# EAGLE schematic Watson (EAGLE 6.2)
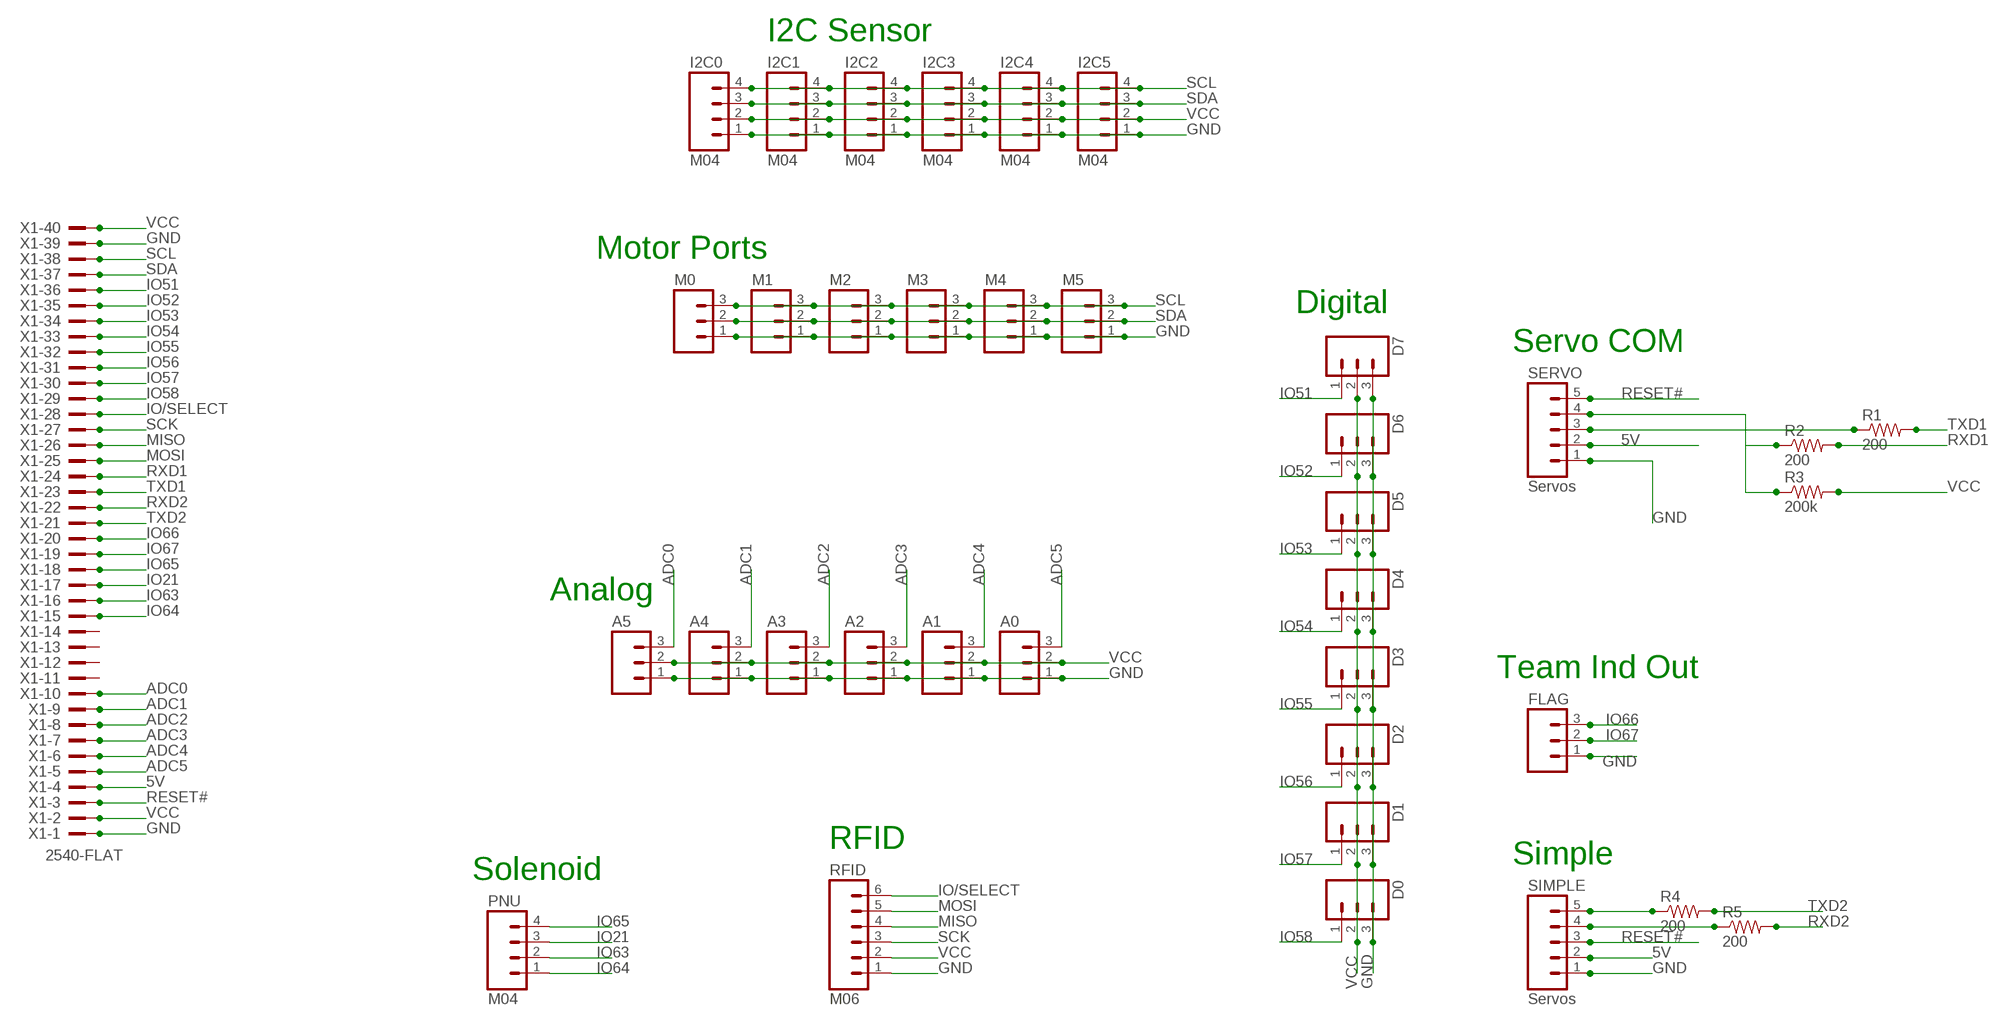
[diagram p0: schematic, sheet 1]

## Parts
A0  M03MTA1X3  [1X03]
A1  M03MTA1X3  [1X03]
A2  M03MTA1X3  [1X03]
A3  M03MTA1X3  [1X03]
A4  M03MTA1X3  [1X03]
A5  M03MTA1X3  [1X03]
D0  M03MTA1X3  [1X03]
D1  M03MTA1X3  [1X03]
D2  M03MTA1X3  [1X03]
D3  M03MTA1X3  [1X03]
D4  M03MTA1X3  [1X03]
D5  M03MTA1X3  [1X03]
D6  M03MTA1X3  [1X03]
D7  M03MTA1X3  [1X03]
FLAG  M03MTA1X3  [1X03]
I2C0  M04  [1X04]
I2C1  M04  [1X04]
I2C2  M04  [1X04]
I2C3  M04  [1X04]
I2C4  M04  [1X04]
I2C5  M04  [1X04]
M0  M03MTA1X3  [1X03]
M1  M03MTA1X3  [1X03]
M2  M03MTA1X3  [1X03]
M3  M03MTA1X3  [1X03]
M4  M03MTA1X3  [1X03]
M5  M03MTA1X3  [1X03]
PNU  M04  [1X04]
R1  200  R-US_R0603  [R0603]
R2  200  R-US_R0603  [R0603]
R3  200k  R-US_R0603  [R0603]
R4  200  R-US_R0603  [R0603]
R5  200  R-US_R0603  [R0603]
RFID  M06  [1X06]
SERVO  Servos  M05  [1X05]
SIMPLE  Servos  M05  [1X05]
X1  2540-FLAT  [PAK100/2500-40]

## Nets
5V: SERVO.2 SIMPLE.2 X1.4
ADC0: A5.3 X1.10
ADC1: A4.3 X1.9
ADC2: A3.3 X1.8
ADC3: A2.3 X1.7
ADC4: A1.3 X1.6
ADC5: A0.3 X1.5
GND: A0.1 A1.1 A2.1 A3.1 A4.1 A5.1 D0.3 D1.3 D2.3 D3.3 D4.3 D5.3 D6.3 D7.3 FLAG.1 I2C0.1 I2C1.1 I2C2.1 I2C3.1 I2C4.1 I2C5.1 M0.1 M1.1 M2.1 M3.1 M4.1 M5.1 RFID.1 SERVO.1 SIMPLE.1 X1.1 X1.39
IO21: PNU.3 X1.17
IO51: D7.1 X1.36
IO52: D6.1 X1.35
IO53: D5.1 X1.34
IO54: D4.1 X1.33
IO55: D3.1 X1.32
IO56: D2.1 X1.31
IO57: D1.1 X1.30
IO58: D0.1 X1.29
IO63: PNU.2 X1.16
IO64: PNU.1 X1.15
IO65: PNU.4 X1.18
IO66: FLAG.3 X1.20
IO67: FLAG.2 X1.19
IO/SELECT: RFID.6 X1.28
MISO: RFID.4 X1.26
MOSI: RFID.5 X1.25
N$1: R2.1 R3.1 SERVO.4
N$2: R1.1 SERVO.3
N$5: R4.1 SIMPLE.5
N$6: R5.1 SIMPLE.4
RESET#: SERVO.5 SIMPLE.3 X1.3
RXD1: R2.2 X1.24
RXD2: R5.2 X1.22
SCK: RFID.3 X1.27
SCL: I2C0.4 I2C1.4 I2C2.4 I2C3.4 I2C4.4 I2C5.4 M0.3 M1.3 M2.3 M3.3 M4.3 M5.3 X1.38
SDA: I2C0.3 I2C1.3 I2C2.3 I2C3.3 I2C4.3 I2C5.3 M0.2 M1.2 M2.2 M3.2 M4.2 M5.2 X1.37
TXD1: R1.2 X1.23
TXD2: R4.2 X1.21
VCC: A0.2 A1.2 A2.2 A3.2 A4.2 A5.2 D0.2 D1.2 D2.2 D3.2 D4.2 D5.2 D6.2 D7.2 I2C0.2 I2C1.2 I2C2.2 I2C3.2 I2C4.2 I2C5.2 R3.2 RFID.2 X1.2 X1.40
Unconnected: X1.11 X1.12 X1.13 X1.14

## Notes on the sheet
- I2C Sensor
- Motor Ports
- Digital
- Servo COM
- Analog
- Team Ind Out
- RFID
- Simple
- Solenoid

## Library data of the parts
A0 A1-A5 D0 D1-D7 FLAG M0 M1-M5 = pie:M03: Header 3 Standard 3-pin 0.1" header. Use with straight break away headers (SKU : PRT-00116), right angle break away headers (PRT-00553), swiss pins (PRT-00743), machine pins (PRT-00117), and female headers (PRT-00115). Molex polarized connector foot print use with SKU : PRT-08232 with associated crimp pins and housings.
I2C0 I2C1-I2C5 PNU = MTA-connectors:M04
R1-R5 = resistor:R-US_: RESISTOR, American symbol
RFID = MTA-connectors:M06
SERVO SIMPLE = MTA-connectors:M05
X1 = pie:2540-FLAT: 3M (TM) Pak 100 4-Wall Header Source: 3M; OC_FARNELL: unknown; OC_NEWARK: unknown